# Altium schematic sheet FC_MC_SCH.SchDoc
size 381 x 241 mm
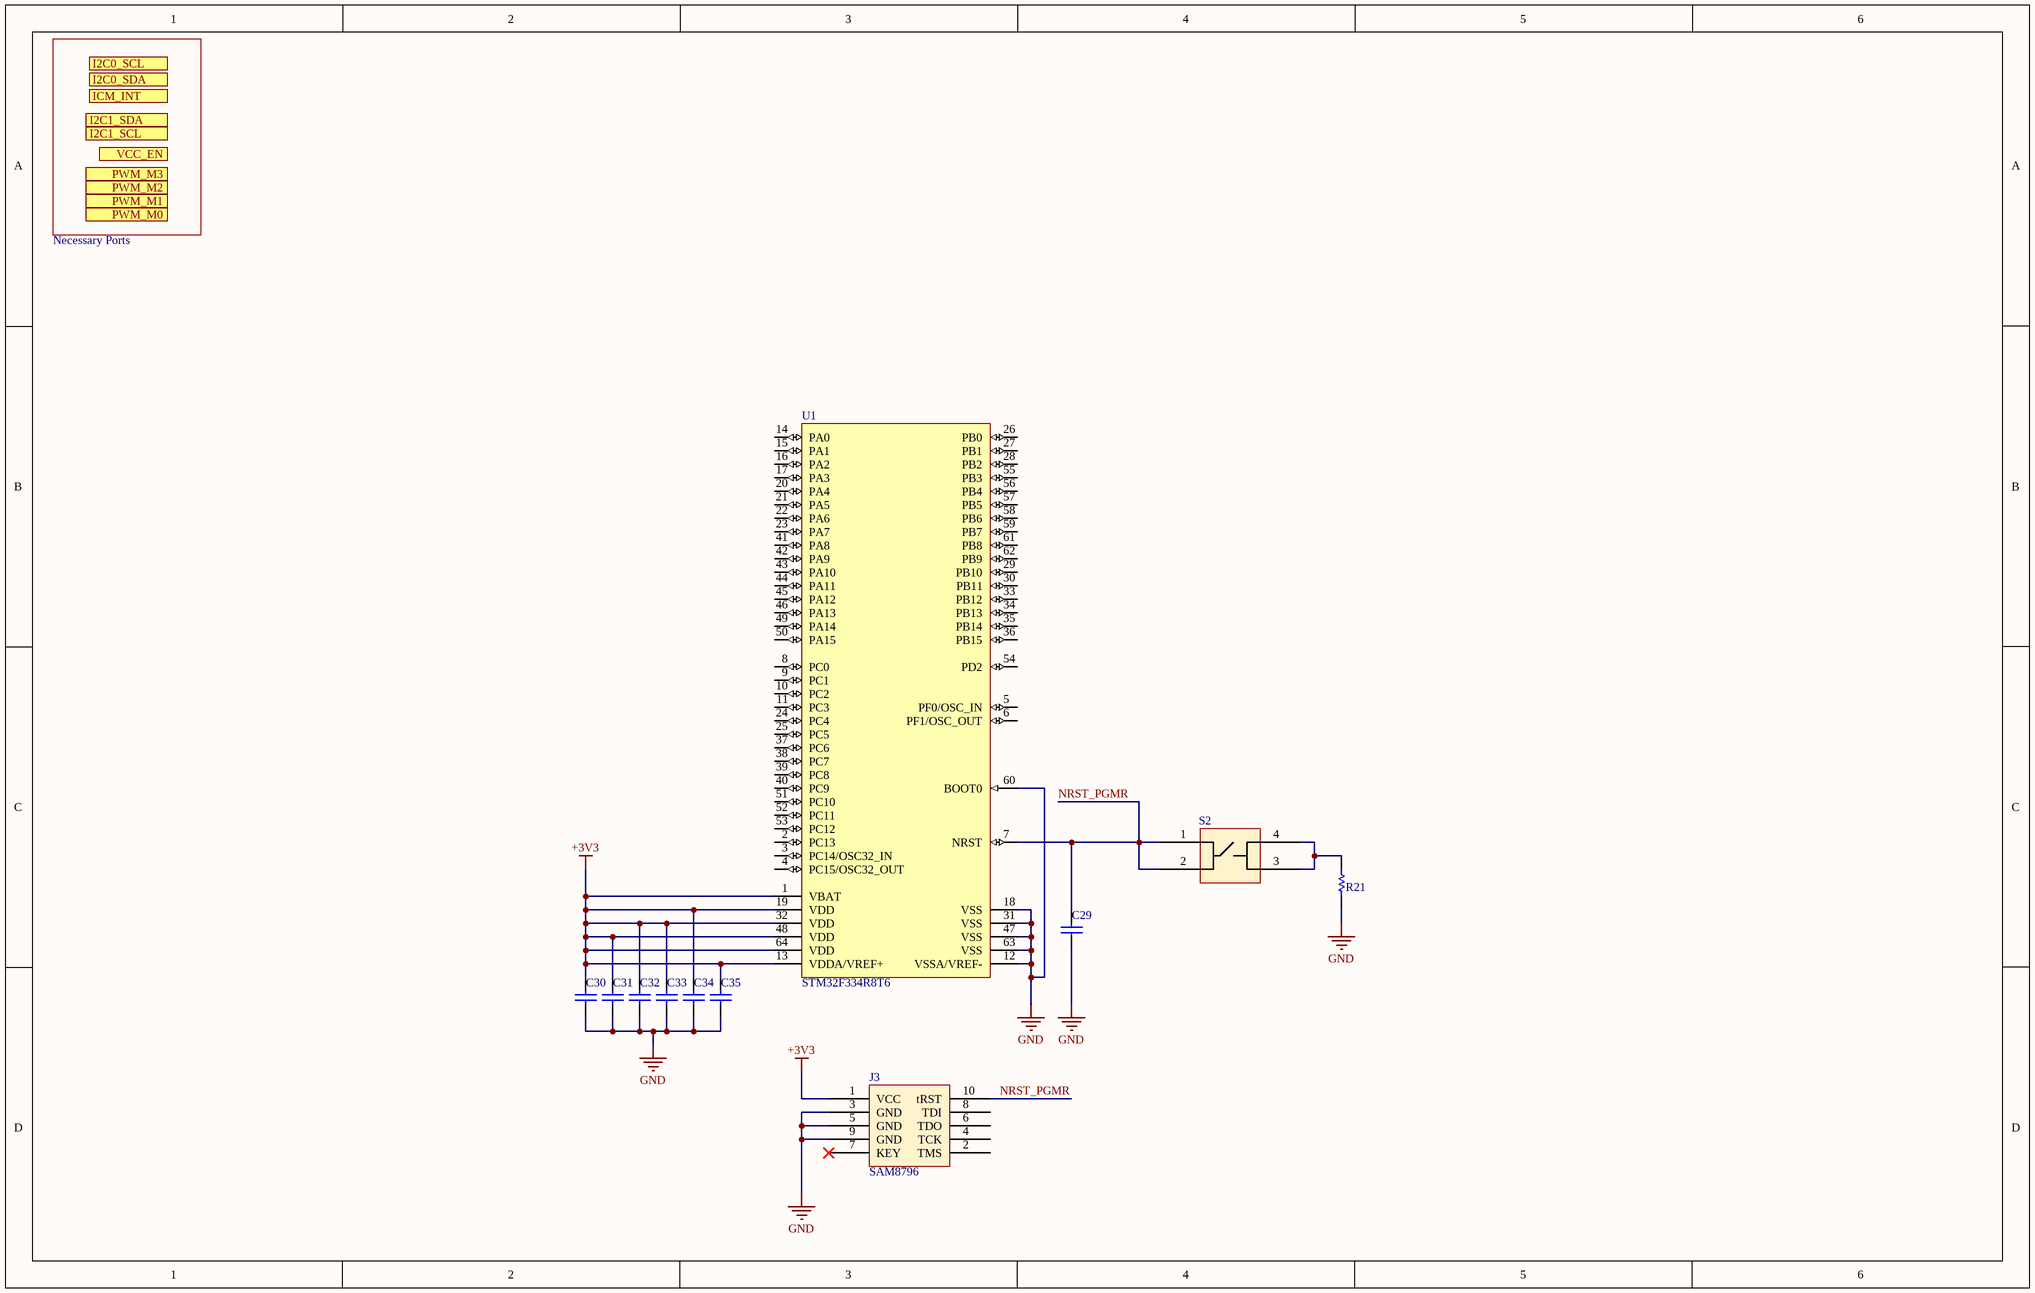
[diagram p0: FC_MC_SCH.SchDoc]

## Parts
C29  CAP0402  [CAPC0402(1005)60_L]  (value not drawn)
C30  CAP0402  [CAPC0402(1005)60_L]  (value not drawn)
C31  CAP0402  [CAPC0402(1005)60_L]  (value not drawn)
C32  CAP0402  [CAPC0402(1005)60_L]  (value not drawn)
C33  CAP0402  [CAPC0402(1005)60_L]  (value not drawn)
C34  CAP0402  [CAPC0402(1005)60_L]  (value not drawn)
C35  CAP0402  [CAPC0402(1005)60_L]  (value not drawn)
J3  SAM8796
R21  RES-2  [RES 0402]  (value not drawn)
S2  PTS 647  (value not drawn)
U1  STM32F334R8T6  [STM-LQFP64_L]

## Ports
I2C0_SCL, I2C0_SDA, I2C1_SCL, I2C1_SDA, ICM_INT, PWM_M0 (in), PWM_M1 (in), PWM_M2 (in), PWM_M3 (in), VCC_EN (in)

## Nets
+3V3: C30.2 C31.2 C32.2 C33.2 C34.2 C35.2 J3.1(VCC) U1.1(VBAT) U1.13(VDDA/VREF+) U1.19(VDD) U1.32(VDD) U1.48(VDD) U1.64(VDD)
GND: C29.1 C30.1 C31.1 C32.1 C33.1 C34.1 C35.1 J3.3(GND) J3.5(GND) J3.9(GND) R21.2 U1.12(VSSA/VREF-) U1.18(VSS) U1.31(VSS) U1.47(VSS) U1.60(BOOT0) U1.63(VSS)
NRST_PGMR: C29.2 J3.10(tRST) S2.1 S2.2 U1.7(NRST)
NetR21_1: R21.1 S2.3 S2.4

Not connected (* = marked no-connect by the designer): J3 2(TMS) 4(TCK) 6(TDO) 7(KEY)* 8(TDI); U1 2(PC13) 3(PC14/OSC32_IN) 4(PC15/OSC32_OUT) 5(PF0/OSC_IN) 6(PF1/OSC_OUT) 8(PC0) 9(PC1) 10(PC2) 11(PC3) 14(PA0) 15(PA1) 16(PA2) 17(PA3) 20(PA4) 21(PA5) 22(PA6) 23(PA7) 24(PC4) 25(PC5) 26(PB0) 27(PB1) 28(PB2) 29(PB10) 30(PB11) 33(PB12) 34(PB13) 35(PB14) 36(PB15) 37(PC6) 38(PC7) 39(PC8) 40(PC9) 41(PA8) 42(PA9) 43(PA10) 44(PA11) 45(PA12) 46(PA13) 49(PA14) 50(PA15) 51(PC10) 52(PC11) 53(PC12) 54(PD2) 55(PB3) 56(PB4) 57(PB5) 58(PB6) 59(PB7) 61(PB8) 62(PB9)

## Notes on the sheet
- Necessary Ports

## Library data of the parts
C29 C31 C33-C35 = CMP-1590-00004-1: 0402 (1005 Metric) Chip Capacitor; Case-EIA: 0402; Value: 100n; Case-Metric: 1005; PackageReference: CAPC0402(1005)60
C30 = CMP-1590-00004-1: 0402 (1005 Metric) Chip Capacitor; Case-EIA: 0402; Value: 1u; Case-Metric: 1005; PackageReference: CAPC0402(1005)60
C32 = CMP-1590-00004-1: 0402 (1005 Metric) Chip Capacitor; Case-EIA: 0402; Value: 4.7u; Case-Metric: 1005; PackageReference: CAPC0402(1005)60
R21 = RES: Value: 5k
S2 = TactileSW
U1 = CMP-0537-00077-1: ARM Cortex-M4 32-bit MCU, 64 KB Flash, 16 KB Internal RAM, 51 I/Os, 64-Pin LQFP, -40 to 85 degC, Tray; Supply Voltage(Vcc) min (V): 2; D/A Converter: 3; Internal RAM Size (kB): 16; FLASH Size (Prog) (kB): 64; Operating Frequency(F) (Processor speed) (MHz): 72; I/Os (High Current): 51; ComponentLink1Description: Manufacturer URL; ComponentLink2URL: http://www.st.com/st-web-ui/static/active/en/resource/technical/document/datasheet/DM00097745.pdf; Package Reference: LQFP64; ComponentLink1URL: http://www.st.com/; ComponentLink2Description: Datasheet; DatasheetVersion: Rev. 4; Mounting Technology: Surface Mount; Package Description: 64-Pin Low-profile Quad Flat Package, Body 10 x 10 mm, Pitch 0.5 mm; Packing: Tray; Core: ARM Cortex-M4